# EAGLE schematic DriverBoardTest (EAGLE 7.2.0)
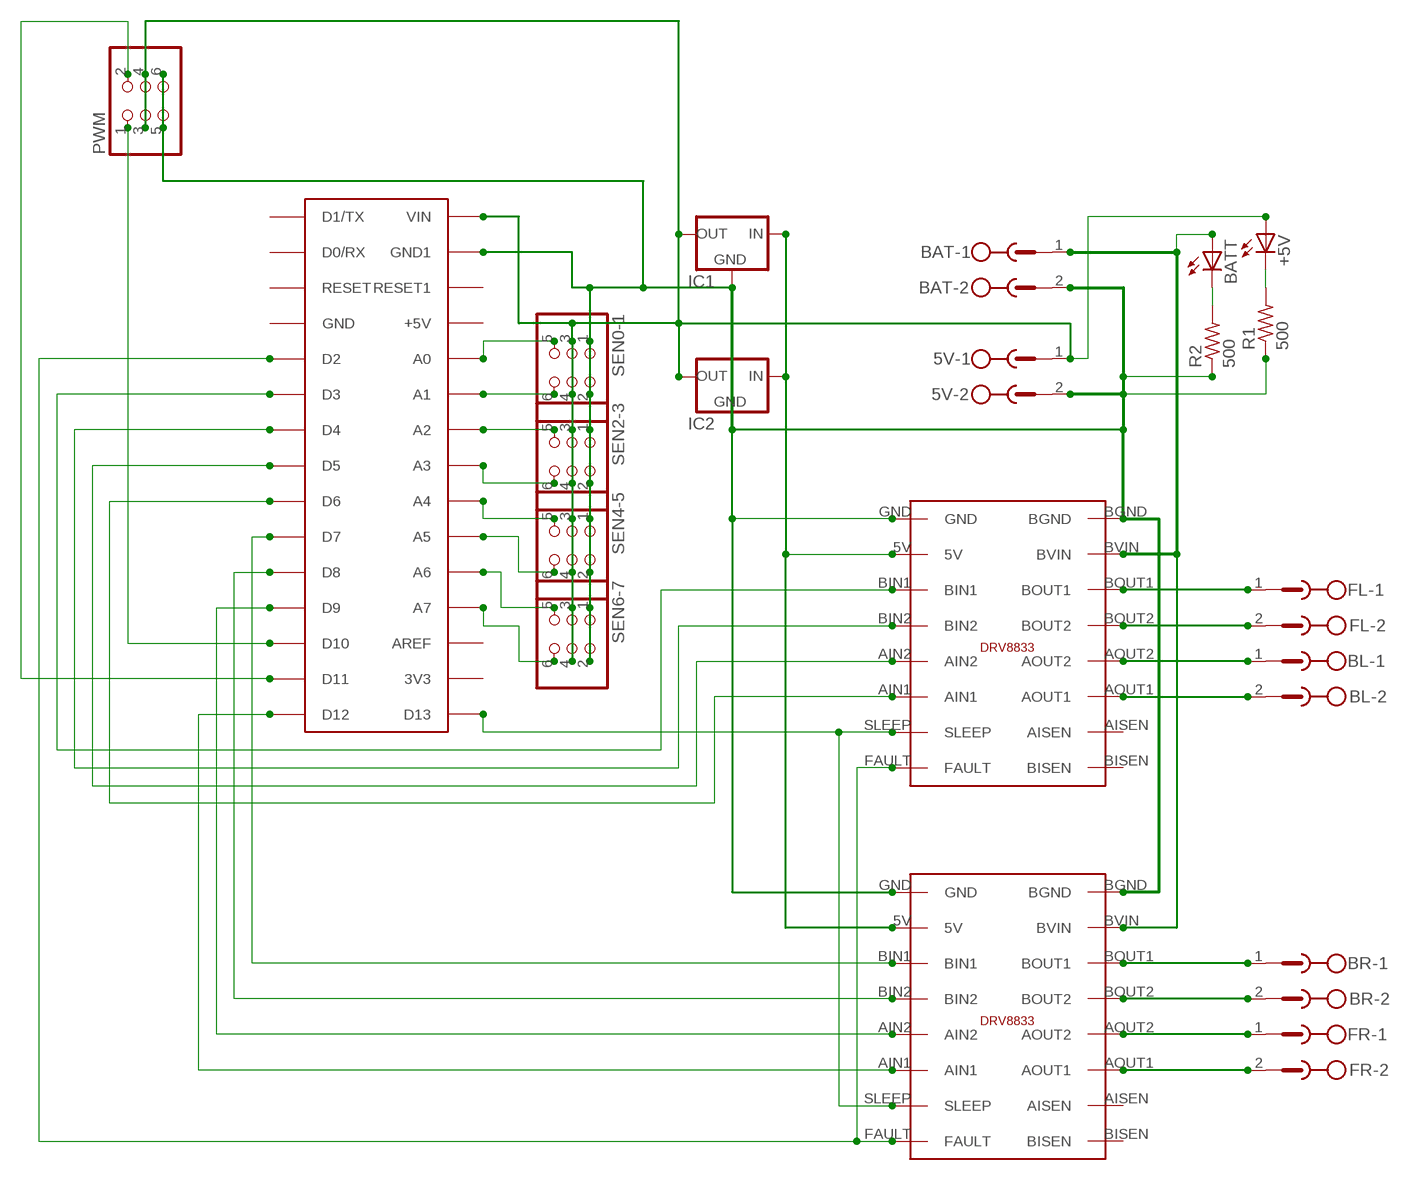
[diagram p0: schematic, sheet 1]

## Parts
5V  MSTBV2  [MSTBV2]
+5V  LED5MM  [LED5MM]
BAT  MSTBV2  [MSTBV2]
BATT  LED5MM  [LED5MM]
BL  MSTBV2  [MSTBV2]
BR  MSTBV2  [MSTBV2]
FL  MSTBV2  [MSTBV2]
FR  MSTBV2  [MSTBV2]
IC1  78XXS  [78XXS]
IC2  78XXS  [78XXS]
PWM  PINHD-2X3  [2X03]
R1  500  R-US_0207/10  [0207/10]
R2  500  R-US_0207/10  [0207/10]
SEN0-1  PINHD-2X3  [2X03]
SEN2-3  PINHD-2X3  [2X03]
SEN4-5  PINHD-2X3  [2X03]
SEN6-7  PINHD-2X3  [2X03]
U$1  ARDUINONANO  [PDIP-32]
U$2  DRV8833  [DRV8833]
U$3  DRV8833  [DRV8833]

## Nets
N$2: 5V.2 BAT.2 IC1.GND IC2.GND PWM.5 PWM.6 R1.1 R2.1 SEN0-1.1 SEN0-1.2 SEN2-3.1 SEN2-3.2 SEN4-5.1 SEN4-5.2 SEN6-7.1 SEN6-7.2 U$1.GND1 U$2.BGND U$2.GND U$3.BGND U$3.GND
N$4: FL.1 U$2.BOUT1
N$5: FL.2 U$2.BOUT2
N$6: BL.1 U$2.AOUT2
N$7: BL.2 U$2.AOUT1
N$8: BR.1 U$3.BOUT1
N$9: BR.2 U$3.BOUT2
N$10: FR.1 U$3.AOUT2
N$11: FR.2 U$3.AOUT1
N$12: BAT.1 BATT.A U$2.BVIN U$3.BVIN
N$13: U$1.D13 U$2.SLEEP U$3.SLEEP
N$14: IC1.IN IC2.IN U$2.5V U$3.5V
N$15: U$1.D3 U$2.BIN1
N$16: U$1.D2 U$2.FAULT U$3.FAULT
N$17: U$1.D4 U$2.BIN2
N$18: U$1.D5 U$2.AIN2
N$19: U$1.D6 U$2.AIN1
N$20: U$1.D7 U$3.BIN1
N$21: U$1.D8 U$3.BIN2
N$22: U$1.D9 U$3.AIN2
N$23: U$1.D12 U$3.AIN1
N$24: PWM.1 U$1.D10
N$25: PWM.2 U$1.D11
N$26: 5V.1 +5V.A IC1.OUT IC2.OUT PWM.3 PWM.4 SEN0-1.3 SEN0-1.4 SEN2-3.3 SEN2-3.4 SEN4-5.3 SEN4-5.4 SEN6-7.3 SEN6-7.4 U$1.VIN
N$27: SEN0-1.5 U$1.A0
N$28: SEN0-1.6 U$1.A1
N$29: SEN2-3.5 U$1.A2
N$30: SEN2-3.6 U$1.A3
N$31: SEN4-5.5 U$1.A4
N$32: SEN4-5.6 U$1.A5
N$33: SEN6-7.5 U$1.A6
N$34: SEN6-7.6 U$1.A7
N$35: BATT.K(C) R2.2
N$37: +5V.K(C) R1.2
Unconnected: U$1.3V3 U$1.+5V U$1.AREF U$1.D0/RX U$1.D1/TX U$1.GND U$1.RESET U$1.RESET1 U$2.AISEN U$2.BISEN U$3.AISEN U$3.BISEN

## Library data of the parts
5V BAT BL BR FL FR = con-phoenix-500:MSTBV2: PHOENIX; OC_FARNELL: unknown; OC_NEWARK: unknown
+5V BATT = led:LED: LED OSRAM: - CHIPLED LG R971, LG N971, LY N971, LG Q971, LY Q971, LO R971, LY R971 LH N974, LH R974 LS Q976, LO Q976, LY Q976 LO Q996 - Hyper CHIPLED LW Q18S LB Q993, LB Q99A, LB R99A - SideLED LS A670, LO A670, LY A670, LG A670, LP A670 LB A673, LV A673, LT A673, LW A673 LH A674 LY A675 LS A676, LA A676, LO A676, LY A676, LW A676 LS A679, LY A679, LG A679 - Hyper Micro SIDELED® LS Y876, LA Y876, LO Y876, LY Y876 LT Y87S - SmartLED LW L88C, LW L88S LB L89C, LB L89S, LG L890 LS L89K, LO L89K, LY L89K LS L896, LA L896, LO L896, LY L896 - TOPLED LS T670, LO T670, LY T670, LG T670, LP T670 LSG T670, LSP T670, LSY T670, LOP T670, LYG T670 LG T671, LOG T671, LSG T671 LB T673, LV T673, LT T673, LW T673 LH T674 LS T676, LA T676, LO T676, LY T676, LB T676, LH T676, LSB T676, LW T676 LB T67C, LV T67C, LT T67C, LS T67K, LO T67K, LY T67K, LW E67C LS E67B, LA E67B, LO E67B, LY E67B, LB E67C, LV E67C, LT E67C LW T67C LS T679, LY T679, LG T679 LS T770, LO T770, LY T770, LG T770, LP T770 LB T773, LV T773, LT T773, LW T773 LH T774 LS E675, LA E675, LY E675, LS T675 LS T776, LA T776, LO T776, LY T776, LB T776 LHGB T686 LT T68C, LB T68C - Hyper Mini TOPLED® LB M676 - Mini TOPLED Santana® LG M470 LS M47K, LO M47K, LY M47K Source: http://www.osram.convergy.de LUXEON: - LUMILED® LXK2-PW12-R00, LXK2-PW12-S00, LXK2-PW14-U00, LXK2-PW14-V00 LXK2-PM12-R00, LXK2-PM12-S00, LXK2-PM14-U00 LXK2-PE12-Q00, LXK2-PE12-R00, LXK2-PE12-S00, LXK2-PE14-T00, LXK2-PE14-U00 LXK2-PB12-K00, LXK2-PB12-L00, LXK2-PB12-M00, LXK2-PB14-N00, LXK2-PB14-P00, LXK2-PB14-Q00 LXK2-PR12-L00, LXK2-PR12-M00, LXK2-PR14-Q00, LXK2-PR14-R00 LXK2-PD12-Q00, LXK2-PD12-R00, LXK2-PD12-S00 LXK2-PH12-R00, LXK2-PH12-S00 LXK2-PL12-P00, LXK2-PL12-Q00, LXK2-PL12-R00 Source: www.luxeon.com KINGBRIGHT: KA-3528ASYC Source: www.kingbright.com
IC1 IC2 = v-reg:78XXS: VOLTAGE REGULATOR
PWM SEN0-1 SEN2-3 SEN4-5 SEN6-7 = pinhead:PINHD-2X3: PIN HEADER
R1 R2 = resistor:R-US_: RESISTOR, American symbol
U$1 = jet-lib:ARDUINONANO
U$2 U$3 = DRV8833:DRV8833: Dual H-Bridge Motor Driver